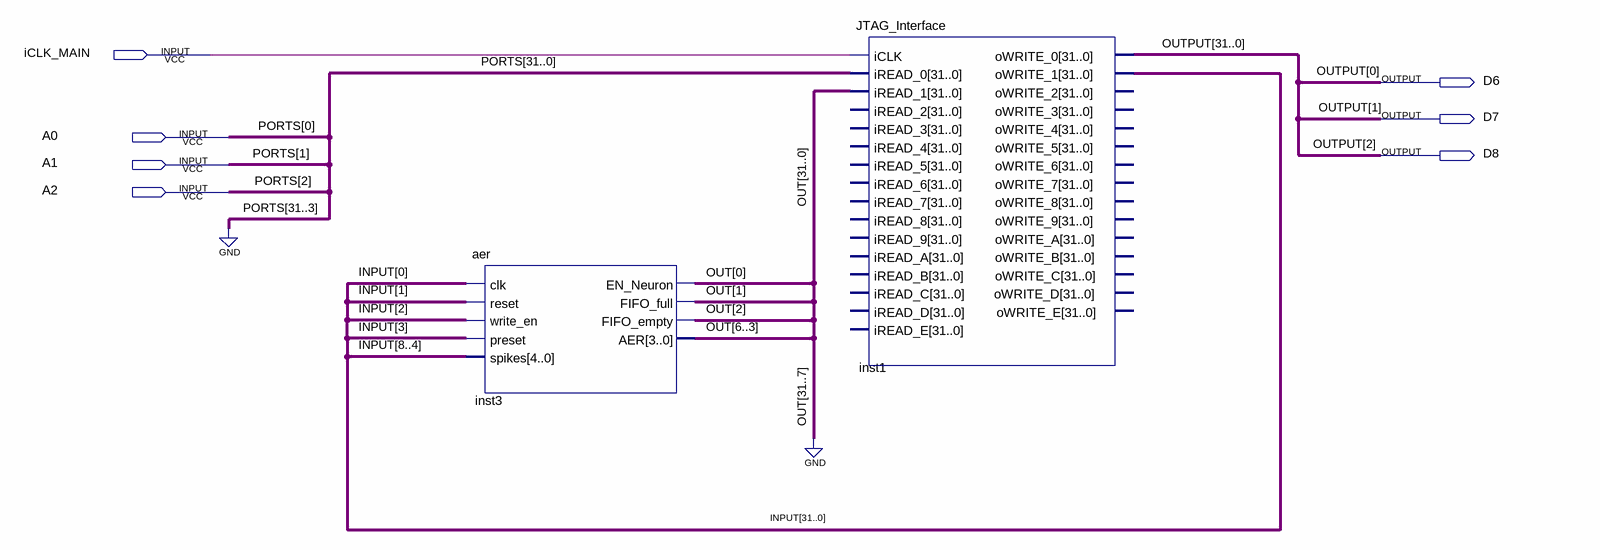
[diagram p0: schematic sheet]
// Quartus schematic MyDesign.bdf as structural Verilog: 2 symbols, 7 pins
module MyDesign (
  input  iCLK_MAIN,
  input  A0,
  input  A1,
  input  A2,
  output D6,
  output D7,
  output D8
);

  wire [6:0] OUT;
  wire [31:0] INPUT;
  wire [31:3] OUTPUT;

  aer inst3 (
    .clk(INPUT[0]), .reset(INPUT[1]), .write_en(INPUT[2]), .preset(INPUT[3]), .spikes(INPUT[8:4]),
    .EN_Neuron(OUT[0]), .FIFO_full(OUT[1]), .FIFO_empty(OUT[2]), .AER(OUT[6:3]));
  JTAG_Interface inst1 (
    .iCLK(iCLK_MAIN), .iREAD_0({{29{1'b0}}, A2, A1, A0}), .iREAD_1({{25{1'b0}}, OUT}),
    .oWRITE_0({OUTPUT, D8, D7, D6}), .oWRITE_1(INPUT));  // open: iREAD_2, iREAD_3, iREAD_4, iREAD_5, iREAD_6, iREAD_7, iREAD_8, iREAD_9, iREAD_A, iREAD_B, iREAD_C, iREAD_D, iREAD_E, oWRITE_2, oWRITE_3, oWRITE_4, oWRITE_5, oWRITE_6, oWRITE_7, oWRITE_8, oWRITE_9, oWRITE_A, oWRITE_B, oWRITE_C, oWRITE_D, oWRITE_E

  // Other names for the same wires on the sheet: OUTPUT[2:0] = {D8, D7, D6}; PORTS[2:0] = {A2, A1, A0}
endmodule
